# Altium schematic sheet 2_EE-10_and_SIM_AFE_Interface.SchDoc: EE-06 mkII. MCU. SIM. ADC. Sensor interfaces
size A4; Revision: 1.0; SheetNumber: 3; SheetTotal: 3
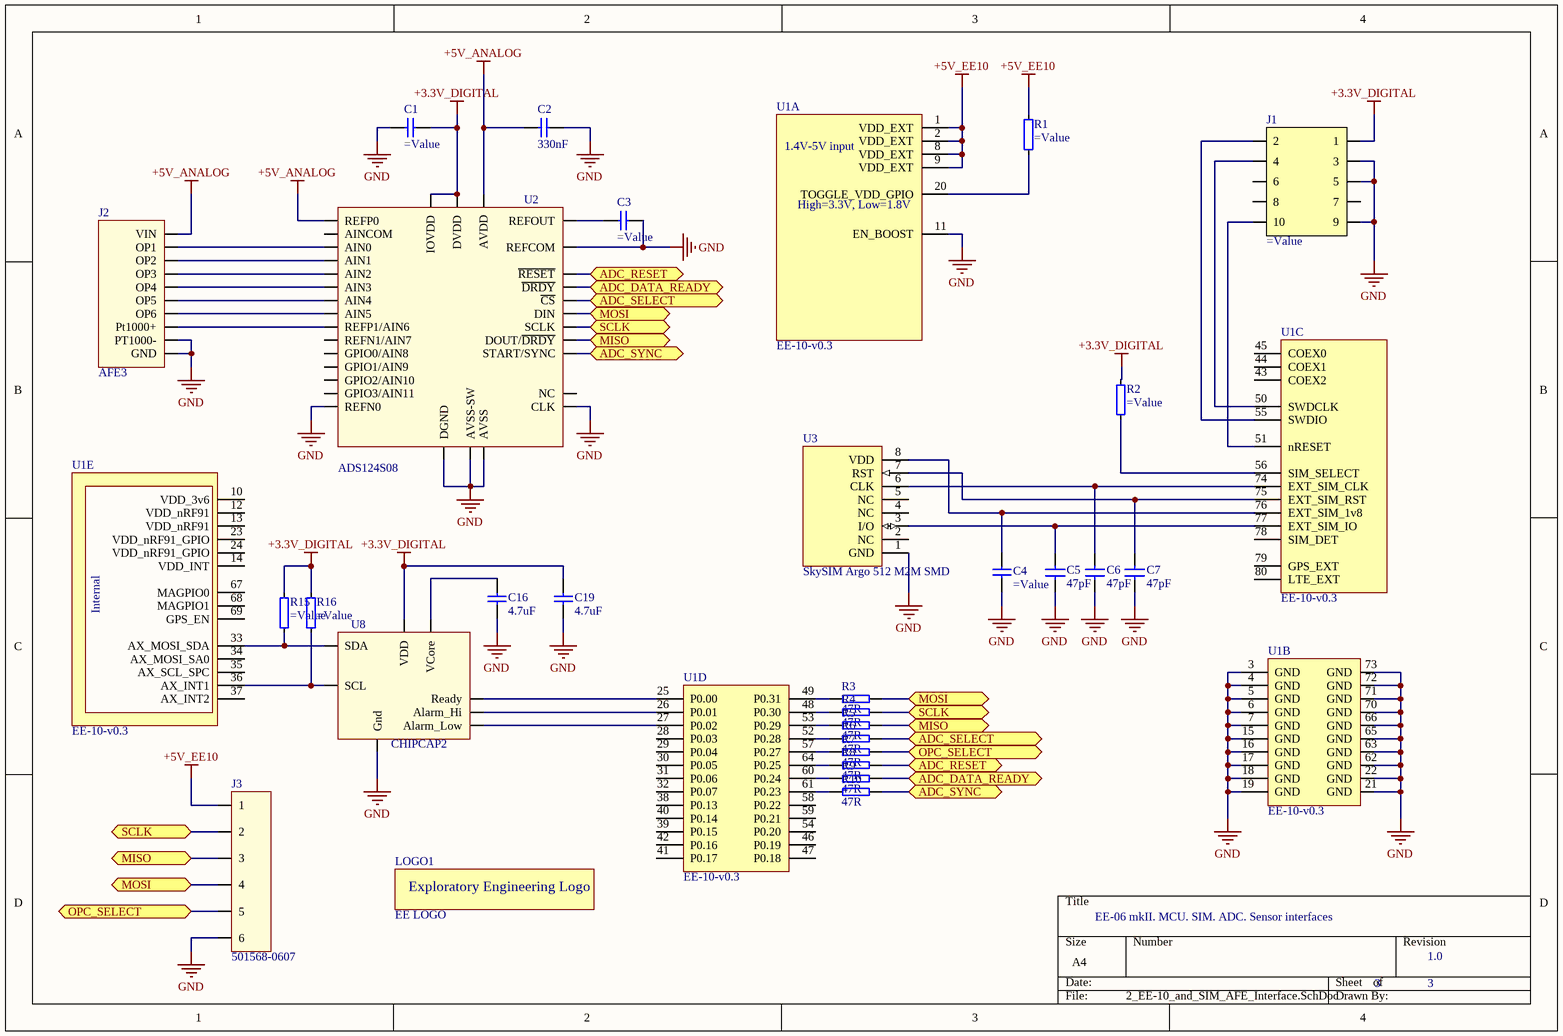
[diagram p0: 2_EE-10_and_SIM_AFE_Interface.SchDoc]

## Parts
C1  (no value)  [CAPC1005X04L]
C2  330nF  [CAPC1005X04L]
C3  (no value)  [CAPC1005X04L]
C4  (no value)  [CAPC1005X04L]
C5  47pF  [CAPC1005X04L]
C6  47pF  [CAPC1005X04L]
C7  47pF  [CAPC1005X04L]
C16  4.7uF  [CAPC1005X04L]
C19  4.7uF  [CAPC1005X04L]
J1  (no value)  [FTSH-105-K]
J2  AFE3  [AFE3_IDC_CABLE]
J3  501568-0607  [CONN 6 PIN PICOCLASP]
LOGO1  EE LOGO  [EE_LOGO]
R1  (no value)  [RESC1005X04L]
R2  (no value)  [RESC1005X04L]
R3  47R  [RESC1005X04L]
R4  47R  [RESC1005X04L]
R5  47R  [RESC1005X04L]
R6  47R  [RESC1005X04L]
R7  47R  [RESC1005X04L]
R8  47R  [RESC1005X04L]
R9  47R  [RESC1005X04L]
R10  47R  [RESC1005X04L]
R15  (no value)  [RESC1005X04L]
R16  (no value)  [RESC1005X04L]
U1  EE-10-v0.3  [EE-10_V0.3]  (parts A,B,C,D,E of 5)
U2  ADS124S08  [PQFP-G32]
U3  SkySIM Argo 512 M2M SMD  [QFN127P500X600X90_HS-9N]
U8  CHIPCAP2  [SENSOR_CHIPCAP2]

## Ports
ADC_DATA_READY (bidir), ADC_RESET (bidir), ADC_SELECT (bidir), ADC_SYNC (bidir), MISO (bidir), MOSI (bidir), OPC_SELECT (bidir), SCLK (bidir)

## Nets
+3.3V_DIGITAL: C1.1 C19.2 J1.1 R2.2 R15.2 R16.2 U2.15(IOVDD) U2.16(DVDD) U8.3(VDD)
+5V_ANALOG: C2.1 J2.5(VIN) U2.26(AVDD) U2.30(REFP0)
+5V_EE10: J3.1 R1.2 U1.1(VDD_EXT) U1.2(VDD_EXT) U1.8(VDD_EXT) U1.9(VDD_EXT)
GND: C1.2 C2.2 C3.2 C4.1 C5.2 C6.2 C7.2 C16.1 C19.1 J1.3 J1.5 J1.9 J2.6(GND) J2.10(PT1000-) J3.6 U1.3(GND) U1.4(GND) U1.5(GND) U1.6(GND) U1.7(GND) U1.11(EN_BOOST) U1.15(GND) U1.16(GND) U1.17(GND) U1.18(GND) U1.19(GND) U1.21(GND) U1.22(GND) U1.62(GND) U1.63(GND) U1.65(GND) U1.66(GND) U1.70(GND) U1.71(GND) U1.72(GND) U1.73(GND) U2.14(DGND) U2.17(CLK) U2.24(REFCOM) U2.27(AVSS) U2.28(AVSS-SW) U2.29(REFN0) U3.1(GND) U8.2(Gnd)
ADC_DATA_READY: R9.2 U2.13(~{DRDY}) ; port ADC_DATA_READY
ADC_RESET: R8.2 U2.18(~{RESET}) ; port ADC_RESET
ADC_SELECT: R6.2 U2.9(~{CS}) ; port ADC_SELECT
ADC_SYNC: R10.2 U2.8(START/SYNC) ; port ADC_SYNC
MISO: J3.3 R5.2 U2.12(DOUT/~{DRDY}) ; port MISO
MOSI: J3.4 R3.2 U2.10(DIN) ; port MOSI
OPC_SELECT: J3.5 R7.2 ; port OPC_SELECT
SCLK: J3.2 R4.2 U2.11(SCLK) ; port SCLK
NetC3_1: C3.1 U2.23(REFOUT)
NetC4_2: C4.2 U1.76(EXT_SIM_1v8) U3.8(VDD)
NetC5_1: C5.1 U1.77(EXT_SIM_IO) U3.3(I/O)
NetC6_1: C6.1 U1.74(EXT_SIM_CLK) U3.6(CLK)
NetC7_1: C7.1 U1.75(EXT_SIM_RST) U3.7(RST)
NetC16_2: C16.2 U8.1(VCore)
NetJ1_2: J1.2 U1.55(SWDIO)
NetJ1_4: J1.4 U1.50(SWDCLK)
NetJ1_10: J1.10 U1.51(nRESET)
NetJ2_1: J2.1(Pt1000+) U2.32(REFP1/AIN6)
NetJ2_2: J2.2(OP2) U2.6(AIN1)
NetJ2_3: J2.3(OP4) U2.4(AIN3)
NetJ2_4: J2.4(OP6) U2.2(AIN5)
NetJ2_7: J2.7(OP5) U2.3(AIN4)
NetJ2_8: J2.8(OP3) U2.5(AIN2)
NetJ2_9: J2.9(OP1) U2.7(AIN0)
NetR1_1: R1.1 U1.20(TOGGLE_VDD_GPIO)
NetR2_1: R2.1 U1.56(SIM_SELECT)
NetR3_1: R3.1 U1.49(P0.31)
NetR4_1: R4.1 U1.48(P0.30)
NetR5_1: R5.1 U1.53(P0.29)
NetR6_1: R6.1 U1.52(P0.28)
NetR7_1: R7.1 U1.57(P0.27)
NetR8_1: R8.1 U1.64(P0.25)
NetR9_1: R9.1 U1.60(P0.24)
NetR10_1: R10.1 U1.61(P0.23)
NetR15_1: R15.1 U1.33(AX_MOSI_SDA) U8.7(SDA)
NetR16_1: R16.1 U1.36(AX_INT1) U8.8(SCL)
NetU1_25: U1.25(P0.00) U8.6(Ready)
NetU1_26: U1.26(P0.01) U8.4(Alarm_Hi)
NetU1_27: U1.27(P0.02) U8.5(Alarm_Low)

Not connected (* = marked no-connect by the designer): J1 6 7 8; U1 10(VDD_3v6) 12(VDD_nRF91) 13(VDD_nRF91) 14(VDD_INT) 23(VDD_nRF91_GPIO) 24(VDD_nRF91_GPIO) 28(P0.03) 29(P0.04) 30(P0.05) 31(P0.06) 32(P0.07) 34(AX_MOSI_SA0) 35(AX_SCL_SPC) 37(AX_INT2) 38(P0.13) 39(P0.15) 40(P0.14) 41(P0.17) 42(P0.16) 43(COEX2) 44(COEX1) 45(COEX0) 46(P0.19) 47(P0.18) 54(P0.20) 58(P0.22) 59(P0.21) 67(MAGPIO0) 68(MAGPIO1) 69(GPS_EN) 78(SIM_DET) 79(GPS_EXT) 80(LTE_EXT); U2 1(AINCOM) 19(GPIO3/AIN11) 20(GPIO2/AIN10) 21(GPIO1/AIN9) 22(GPIO0/AIN8) 25(NC) 31(REFN1/AIN7); U3 2(NC) 4(NC) 5(NC)

## Notes on the sheet
- (in symbol EE-10-v0.3, part A) 1.4V-5V input; High=3.3V, Low=1.8V
- (in symbol EE-10-v0.3, part E) Internal
- (in symbol EE-LOGO) Exploratory Engineering Logo

## Library data of the parts
C1 C4 = GRM155R71C104KA88D: CAP CER 100nF 16V X7R 0402; Manufacturer: Murata Electronics North America; Tolerance: ±10%; Supplier 1: Digi-Key; Manufacturer Part Number: GRM155R71C104KA88D; RoHS: RoHS Compliant; Category: Capacitors; Stock 1: 24649903; Pricing 1: 1=0.16, 10=0.023, 50=0.0126, 100=0.0107, 250=0.00872, 500=0.00746, 1000=0.00581, 5000=0.00485 (EUR); Packaging: Digi-Reel®; Capacitance: 100nF; Voltage - Rated: 16V; Temperature Coefficient: X7R; Mounting Type: Surface Mount, MLCC; Operating Temperature: -55°C ~ 125°C; Applications: General Purpose; Ratings: -; Package / Case: 0402 (1005 Metric); Size / Dimension: 0.039" L x 0.020" W (1.00mm x 0.50mm); Height - Seated (Max): -; Thickness (Max): 0.022" (0.55mm); Lead Spacing: -; Features: -; Lead Style: -; ComponentLink1URL: http://www.murata.com/~/media/webrenewal/support/library/catalog/products/capacitor/mlcc/c02e.pdf; ComponentLink1Description: http://www.murata.com/~/media/webrenewal/support/library/catalog/products/capacitor/mlcc/c02e.pdf; Supplier Part Number 1: 490-3261-6-ND; Value: 100nF
C2 = CC0402KRX5R6BB334: CAP CER 0.33UF 10V X5R 0402; Manufacturer: Yageo; Tolerance: 10%; Supplier 1: Digi-Key; Manufacturer Part Number: CC0402KRX5R6BB334; Stock 1: 18753; Pricing 1: 1=0.11, 10=0.082, 100=0.0364, 500=0.02598, 1000=0.02041, 2500=0.01855, 5000=0.01707 (USD); Mount: Surface Mount; Case/Package: 0402; Weight: 2.3E-05oz; Case Code (Metric): 1005; Case Code (Imperial): 0402; Min Operating Temperature: -55°C; Max Operating Temperature: 85°C; Packaging: Tape and Reel; Capacitance: 330nF; Voltage Rating: 10V; Dielectric: X5R; Termination: SMD/SMT; Composition: Ceramic; Voltage Rating (DC): 10V; Package Quantity: 10000; Length: 0.039inch; Width: 0.02inch; Thickness: 0.022inch; Lead Free: Lead Free; Halogen Free: Halogen Free; ComponentLink1URL: http://www.mouser.com/ds/2/447/Yageo_UPY-GP_NP0_16V-to-50V_9-358835.pdf?src-supplier=Mouser; ComponentLink1Description: http://www.mouser.com/ds/2/447/Yageo_UPY-GP_NP0_16V-to-50V_9-358835.pdf?src-supplier=Mouser; ComponentLink2URL: http://www.yageo.com/exep/pages/download/literatures/ProductSelectionGuide%202014_Final_2.pdf?src-supplier=Digi-Key; ComponentLink2Description: http://www.yageo.com/exep/pages/download/literatures/ProductSelectionGuide%202014_Final_2.pdf?src-supplier=Digi-Key; ComponentLink3URL: http://www.yageo.com/documents/recent/UPY-GPHC_X5R_4V-to-50V_25.pdf?src-supplier=Digi-Key; ComponentLink3Description: http://www.yageo.com/documents/recent/UPY-GPHC_X5R_4V-to-50V_25.pdf?src-supplier=Digi-Key
C3 = GRM155R70J105KA12D: CAP CER 1UF 6.3V X7R 0402; Manufacturer: Murata Electronics North America; Capacitance: 1µF; Tolerance: ±10%; Value: 1µF; Supplier 1: Digi-Key; Manufacturer Part Number: GRM155R70J105KA12D; RoHS: RoHS Compliant; Category: Capacitors; Stock 1: 3321; Pricing 1: 1=0.1, 10=0.072, 50=0.039, 100=0.033, 250=0.027, 500=0.0231, 1000=0.018, 5000=0.015 (USD); Packaging: Digi-Reel®; Part Status: Active; Voltage - Rated: 6.3V; Temperature Coefficient: X7R; Operating Temperature: -55°C ~ 125°C; Features: Derating Recommended; Ratings: -; Applications: General Purpose; Failure Rate: *; Mounting Type: Surface Mount, MLCC; Package / Case: 0402 (1005 Metric); Size / Dimension: 0.039" L x 0.020" W (1.00mm x 0.50mm); Height - Seated (Max): -; Thickness (Max): 0.022" (0.55mm); Lead Spacing: -; Lead Style: -; ComponentLink1URL: http://www.murata.com/~/media/webrenewal/support/library/catalog/products/capacitor/mlcc/c02e.pdf; ComponentLink1Description: http://www.murata.com/~/media/webrenewal/support/library/catalog/products/capacitor/mlcc/c02e.pdf; Supplier Part Number 1: 490-10024-6-ND
C5-C7 = GRM1555C1H470FA01D: Multilayer Ceramic Capacitors MLCC - SMD/SMT 0402 47pF 50volts C0G 1%; Value: 47pF
C16 C19 = GRM155R60J475ME47D: CAP CER 4.7UF 6.3V X5R 0402; Manufacturer: Murata; Tolerance: 20%; Supplier 1: Digi-Key; Manufacturer Part Number: GRM155R60J475ME47D; Stock 1: 28862984; Pricing 1: 1=0.15, 10=0.109, 100=0.051, 500=0.03578, 1000=0.02962, 2500=0.02756, 5000=0.02522 (USD); Mount: Surface Mount; Case/Package: 0402; Weight: 0.000212oz; Case Code (Metric): 1005; Case Code (Imperial): 0402; Contact Plating: Tin; Min Operating Temperature: -55°C; Max Operating Temperature: 85°C; Package Quantity: 10000; Capacitance: 4.7uF; Voltage Rating: 6.3V; Packaging: Tape and Reel; Dielectric: X5R; Termination: SMD/SMT; Voltage: 6.3V; Voltage Rating (DC): 6.3V; Length: 1mm; Height: 0.5mm; Width: 0.02inch; Thickness: 0.022inch; Depth: 0.5mm; REACH SVHC: No SVHC; Lead Free: Lead Free; ComponentLink1URL: https://www.murata.com/~/media/webrenewal/support/library/catalog/products/capacitor/mlcc/c02e.ashx?la=en-us&src-supplier=Digi-Key; ComponentLink1Description: https://www.murata.com/~/media/webrenewal/support/library/catalog/products/capacitor/mlcc/c02e.ashx?la=en-us&src-supplier=Digi-Key; ComponentLink2URL: http://www.farnell.com/datasheets/2047949.pdf?src-supplier=Element14; ComponentLink2Description: http://www.farnell.com/datasheets/2047949.pdf?src-supplier=Element14
J1 = FTSH-105-01-F-DV-K-P: CONN HEADER 10POS DUAL .05" SMD; Manufacturer: Samtec Inc.; Connector Type: Header, Shrouded; Number of Positions: 10; Number of Positions Loaded: All; Pitch: 0.050" (1.27mm); Supplier 1: Digi-Key; Manufacturer Part Number: FTSH-105-01-F-DV-K-P; RoHS: RoHS Compliant; Category: Connectors, Interconnects; Stock 1: 160; Pricing 1: 1=3.48, 10=2.948, 50=2.546, 100=2.278, 250=2.01, 500=1.876, 1000=1.742, 2500=1.675, 5000=1.6415 (USD); Packaging: Tube; Contact Type: Male Pin; Number of Rows: 2; Row Spacing: 0.050" (1.27mm); Contact Mating Length: 0.120" (3.05mm); Mounting Type: Surface Mount; Termination: Solder; Fastening Type: -; Features: -; Contact Finish: Gold; Contact Finish Thickness: 3µin (0.08µm); Color: Black; ComponentLink1URL: http://suddendocs.samtec.com/prints/ftsh-1xx-xx-xxx-dv-xxx-mkt.pdf; ComponentLink1Description: http://suddendocs.samtec.com/prints/ftsh-1xx-xx-xxx-dv-xxx-mkt.pdf; Supplier Part Number 1: SAM8797-ND; Value: FTSH-105-01-F-DV-K-P
J3 = 501568-0607: CONN HEADER SMD R/A 6POS 1MM; Manufacturer: Molex; Current Rating: 1A; Voltage Rating: 50V; Number of Positions: 6; Gender: Male; Connector Type: Male Pin; Max Voltage Rating (DC): 5.05kV; Glow Wire Compliant: Non-compliant; Supplier 1: Digi-Key; Manufacturer Part Number: 501568-0607; Stock 1: 39745; Pricing 1: 1=0.77, 10=0.675, 100=0.5825, 500=0.47658 (USD); Mount: Surface Mount; Color: Natural; Contact Material: Bronze,Brass; Housing Color: Natural; Housing Material: Thermoplastic; Contact Plating: Tin; Min Operating Temperature: -40°C; Max Operating Temperature: 85°C; Number of Rows: 1; Packaging: Tape and Reel; Package Quantity: 1; Termination: Solder; Fastening Type: Detent; Number of Contacts: 6; Orientation: Right Angle; Voltage Rating (AC): 50V; Max Voltage Rating (AC): 50V; Voltage Rating (DC): 50V; Number of Circuits: 6; Length: 8mm; Pitch: 1mm; Depth: 5.35mm; Radiation Hardening: No; REACH SVHC: Unknown; Lead Free: Lead Free; ComponentLink1URL: https://www.molex.com/pdm_docs/ps/PS-501568-001.pdf?src-supplier=Digi-Key; ComponentLink1Description: https://www.molex.com/pdm_docs/ps/PS-501568-001.pdf?src-supplier=Digi-Key; ComponentLink2URL: http://www.mouser.com/ds/2/276/5015680607_PCB_HEADERS-155422.pdf?src-supplier=Mouser; ComponentLink2Description: http://www.mouser.com/ds/2/276/5015680607_PCB_HEADERS-155422.pdf?src-supplier=Mouser; ComponentLink3URL: http://www.molex.com/webdocs/datasheets/pdf/en-us/5015680607_PCB_HEADERS.pdf?src-supplier=Avnet; ComponentLink3Description: http://www.molex.com/webdocs/datasheets/pdf/en-us/5015680607_PCB_HEADERS.pdf?src-supplier=Avnet; ComponentLink4URL: http://uk.rs-online.com/webdocs/13c5/0900766b813c54a2.pdf?src-supplier=RSComponents; ComponentLink4Description: http://uk.rs-online.com/webdocs/13c5/0900766b813c54a2.pdf?src-supplier=RSComponents; ComponentLink5URL: http://www.farnell.com/datasheets/1912348.pdf?src-supplier=Element14; ComponentLink5Description: http://www.farnell.com/datasheets/1912348.pdf?src-supplier=Element14; ComponentLink6URL: http://www.molex.com/webdocs/datasheets/pdf/en-us/5015680607_PCB_HEADERS.pdf?src-supplier=Avnet+Europe; ComponentLink6Description: http://www.molex.com/webdocs/datasheets/pdf/en-us/5015680607_PCB_HEADERS.pdf?src-supplier=Avnet+Europe
LOGO1 = EE-LOGO: Exploratory Engineering Logo Silkscreen
R1 R2 R15 R16 = RC0402FR-0710KL: RES SMD 10K OHM 1% 1/16W 0402; Manufacturer: Yageo; Power (Watts): 0.063W, 1/16W; Temperature Coefficient: ±100ppm/°C; Supplier 1: Digi-Key; Manufacturer Part Number: RC0402FR-0710KL; RoHS: RoHS Compliant; Category: Resistors; Stock 1: 3763255; Pricing 1: 1=0.1, 10=0.013, 25=0.0096, 100=0.0054, 250=0.00412, 500=0.00328, 1000=0.00242, 2500=0.0021, 5000=0.00173 (USD); Packaging: Digi-Reel®; Resistance (Ohms): 10k; Tolerance: ±1%; Composition: Thick Film; Features: Moisture Resistant; Operating Temperature: -55°C ~ 155°C; Package / Case: 0402 (1005 Metric); Supplier Device Package: 0402; Size / Dimension: 0.039" L x 0.020" W (1.00mm x 0.50mm); Height: 0.016" (0.40mm); Number of Terminations: 2; ComponentLink1URL: http://www.yageo.com/NewPortal/yageodocoutput?fileName=/pdf/R-Chip/PYu-RC_Group_51_RoHS_L_3.pdf; ComponentLink1Description: http://www.yageo.com/NewPortal/yageodocoutput?fileName=/pdf/R-Chip/PYu-RC_Group_51_RoHS_L_3.pdf; Supplier Part Number 1: 311-10.0KLRDKR-ND; Value: 10k
R3-R10 = RC0402JR-0747RL: RES SMD 47 OHM 5% 1/16W 0402; Manufacturer: Yageo; Power Rating: 62.5mW; Voltage Rating: 50V; Temperature Coefficient: 100ppm/°C; Supplier 1: Digi-Key; Manufacturer Part Number: RC0402JR-0747RL; Stock 1: 2780035; Pricing 1: 1=0.1, 10=0.013, 100=0.0053, 1000=0.00236, 2500=0.00205, 5000=0.00169 (USD); Case/Package: 0402; Weight: 2.3E-05oz; Case Code (Imperial): 0402; Case Code (Metric): 1005; Min Operating Temperature: -55°C; Max Operating Temperature: 155°C; Resistance: 47R; Tolerance: 5%; Packaging: Tape and Reel; Composition: Thick Film; Termination: SMD/SMT; Military Standard: Not; Length: 1mm; Height: 0.35mm; Width: 0.5mm; Depth: 0.5mm; REACH SVHC: Unknown; Lead Free: Lead Free; ComponentLink1URL: http://www.mouser.com/ds/2/447/PYu-RC0402_51_RoHS_L_6_r-8721.pdf?src-supplier=Mouser; ComponentLink1Description: http://www.mouser.com/ds/2/447/PYu-RC0402_51_RoHS_L_6_r-8721.pdf?src-supplier=Mouser; ComponentLink2URL: http://www.farnell.com/datasheets/1018594.pdf?src-supplier=Element14; ComponentLink2Description: http://www.farnell.com/datasheets/1018594.pdf?src-supplier=Element14
U1 = EE-10-v0.3: EE-10 v0.3 PCB Module; Manufacturer: Telenor; Manufacturer Part Number: EE-10-v0.3
U2 = ADS124S08IPBS: IC ADC 24BIT 8CH I2C 32-TQFP; Manufacturer: Texas Instruments; Interface: SPI; Number of Inputs: 12; Number of Bits: 24; Sampling Rate: 4000S/s; Number of A/D Converters: 1; Supplier 1: Digi-Key; Manufacturer Part Number: ADS124S08IPBS; Stock 1: 1055; Pricing 1: 1=10.47, 10=9.46, 25=9.02, 100=7.832, 500=6.82, 1000=5.94 (USD); Mount: Surface Mount; Case/Package: LQFP; Min Operating Temperature: -50°C; Max Operating Temperature: 125°C; Packaging: Tray; ComponentLink1URL: http://www.ti.com/lit/ds/symlink/ads124s06.pdf?src-supplier=Digi-Key; ComponentLink1Description: http://www.ti.com/lit/ds/symlink/ads124s06.pdf?src-supplier=Digi-Key
U3 = SKYSIM-ARGO-LTE-MFF2: SkySIM® Argo 512 M2M SMD - LTE; Value: SkySIM Argo 512 M2M SMD
U8 = CC2D23S: SENSOR HUMI/TEMP 3.3V I2C 2% SMD; Manufacturer: Amphenol; Manufacturer Part Number: CC2A35; Operating Supply Voltage: 5V; Response Time: 7s; Accuracy: 3%; Sensor Type: Temperature; Output Type: Analog,Digital; Sensing Method: Capacitive; Max Supply Voltage (DC): 5.5V; Min Supply Voltage (DC): 2.7V; Resolution: 14b; Operating Supply Current: 750uA; Supplier 1: Digi-Key; Stock 1: 217; Pricing 1: 1=11.57, 5=10.15, 10=9.135, 25=8.12, 50=7.511, 100=6.496, 250=6.293, 500=6.09, 1000=5.684 (USD); Mount: Surface Mount; Case/Package: SMD/SMT; Number of Pins: 8; Min Operating Temperature: -40°C; Max Operating Temperature: 125°C; Package Quantity: 100; Termination: SMD/SMT; Interface: I2C; Packaging: Tape and Reel; Length: 0.236inch; Height: 0.075inch; Width: 0.157inch; Lead Free: Lead Free; ComponentLink1URL: https://www.alliedelec.com/m/d/304a63eb9a1f3ec115d303d9c5ab2e99.pdf?src-supplier=Allied+Electronics; ComponentLink1Description: https://www.alliedelec.com/m/d/304a63eb9a1f3ec115d303d9c5ab2e99.pdf?src-supplier=Allied+Electronics; ComponentLink2URL: http://www.farnell.com/datasheets/1706532.pdf?src-supplier=Element14; ComponentLink2Description: http://www.farnell.com/datasheets/1706532.pdf?src-supplier=Element14